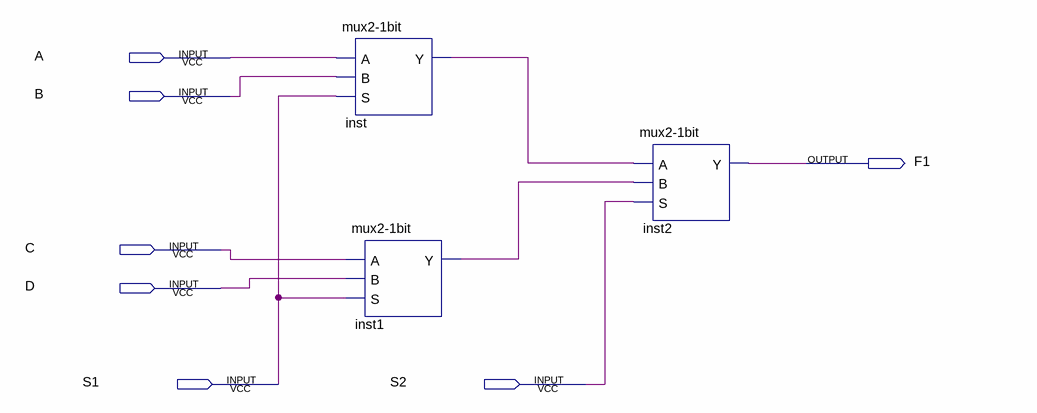
[diagram p0: schematic sheet]
// Quartus schematic MUX4-1bit.bdf as structural Verilog: 3 symbols, 7 pins
module \MUX4-1bit  (
  input  A,
  input  B,
  input  C,
  input  D,
  input  S1,
  input  S2,
  output F1
);

  wire inst1_y, inst_y;

  \mux2-1bit  inst (.A(A), .B(B), .S(S1), .Y(inst_y));
  \mux2-1bit  inst1 (.A(C), .B(D), .S(S1), .Y(inst1_y));
  \mux2-1bit  inst2 (.A(inst_y), .B(inst1_y), .S(S2), .Y(F1));
endmodule
